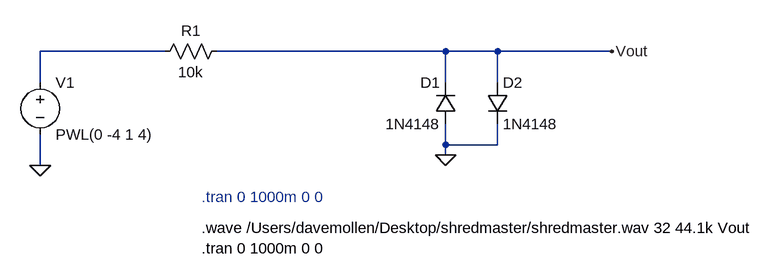
[diagram p0: schematic clipper.asc]
clipper.asc, the LTspice schematic file:
Version 4
SHEET 1 1092 680
WIRE -144 144 -336 144
WIRE 288 144 -64 144
WIRE 368 144 288 144
WIRE 544 144 368 144
WIRE -336 192 -336 144
WIRE 288 192 288 144
WIRE 368 192 368 144
WIRE 288 288 288 256
WIRE 368 288 368 256
WIRE 368 288 288 288
WIRE 288 304 288 288
WIRE -336 320 -336 272
FLAG -336 320 0
FLAG 544 144 Vout
FLAG 288 304 0
SYMBOL diode 304 256 R180
WINDOW 0 24 64 Left 2
WINDOW 3 24 0 Left 2
SYMATTR InstName D1
SYMATTR Value 1N4148
SYMBOL diode 352 192 R0
SYMATTR InstName D2
SYMATTR Value 1N4148
SYMBOL res -48 128 R90
WINDOW 0 0 56 VBottom 2
WINDOW 3 32 56 VTop 2
SYMATTR InstName R1
SYMATTR Value 10k
SYMBOL voltage -336 176 R0
SYMATTR InstName V1
SYMATTR Value PWL(0 -4 1 4)
TEXT -88 368 Left 2 ;.tran 0 1000m 0 0
TEXT -88 416 Left 2 !.wave /Users/davemollen/Desktop/shredmaster/shredmaster.wav 32 44.1k Vout\n.tran 0 1000m 0 0

The netlist it stands for:
* clipper.asc
D1 0 Vout 1N4148
D2 Vout 0 1N4148
R1 Vout N001 10k
V1 N001 0 PWL(0 -4 1 4)
.model D D
.lib standard.dio
* .tran 0 1000m 0 0
.wave /Users/davemollen/Desktop/shredmaster/shredmaster.wav 32 44.1k Vout
.tran 0 1000m 0 0
.backanno
.end